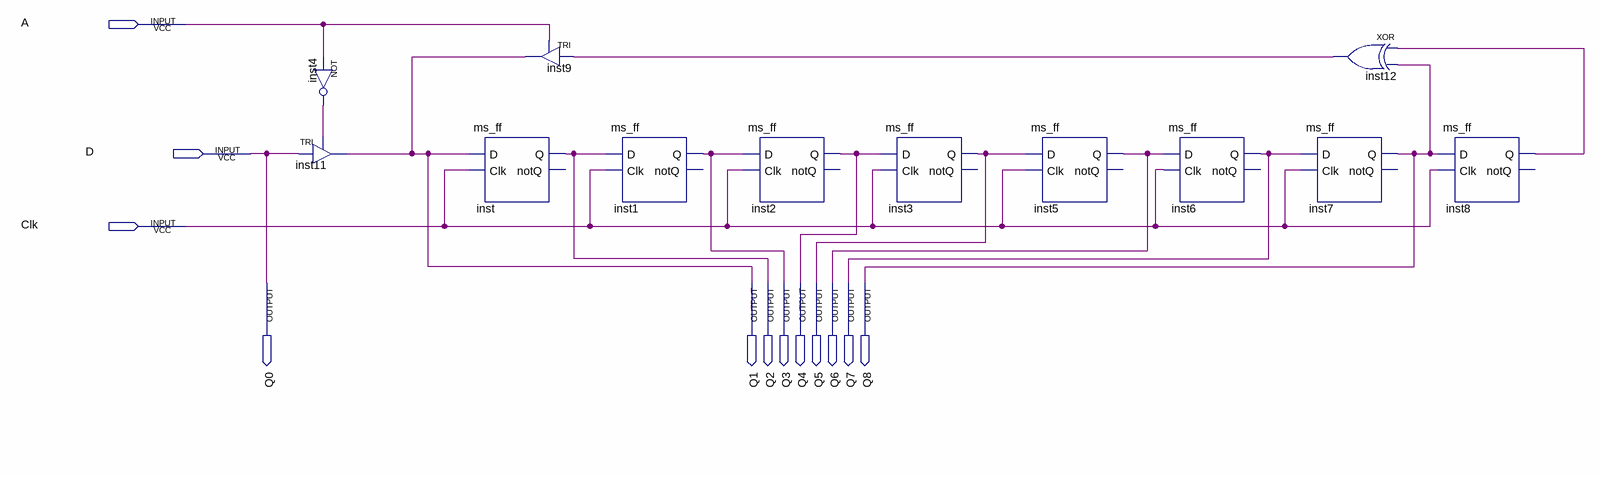
[diagram p0: schematic sheet]
// Quartus schematic register.bdf as structural Verilog: 12 symbols, 12 pins
module register (
  input  A,
  input  D,
  input  Clk,
  output Q0,
  output Q1,
  output Q2,
  output Q3,
  output Q4,
  output Q5,
  output Q6,
  output Q7,
  output Q8
);

  wire inst4_out, inst8_q, inst12_out;

  not inst4 (inst4_out, A);
  TRI inst11 (.IN(D), .OE(inst4_out), .OUT(Q1));
  ms_ff inst (.D(Q1), .Clk(Clk), .Q(Q2));  // open: notQ
  TRI inst9 (.IN(inst12_out), .OE(A), .OUT(Q1));
  ms_ff inst1 (.D(Q2), .Clk(Clk), .Q(Q3));  // open: notQ
  ms_ff inst2 (.D(Q3), .Clk(Clk), .Q(Q4));  // open: notQ
  ms_ff inst3 (.D(Q4), .Clk(Clk), .Q(Q5));  // open: notQ
  ms_ff inst5 (.D(Q5), .Clk(Clk), .Q(Q6));  // open: notQ
  ms_ff inst6 (.D(Q6), .Clk(Clk), .Q(Q7));  // open: notQ
  ms_ff inst7 (.D(Q7), .Clk(Clk), .Q(Q8));  // open: notQ
  xor inst12 (inst12_out, inst8_q, Q8);
  ms_ff inst8 (.D(Q8), .Clk(Clk), .Q(inst8_q));  // open: notQ

  assign Q0 = D;
endmodule
